# EAGLE design M510A (EAGLE 6.6.0)
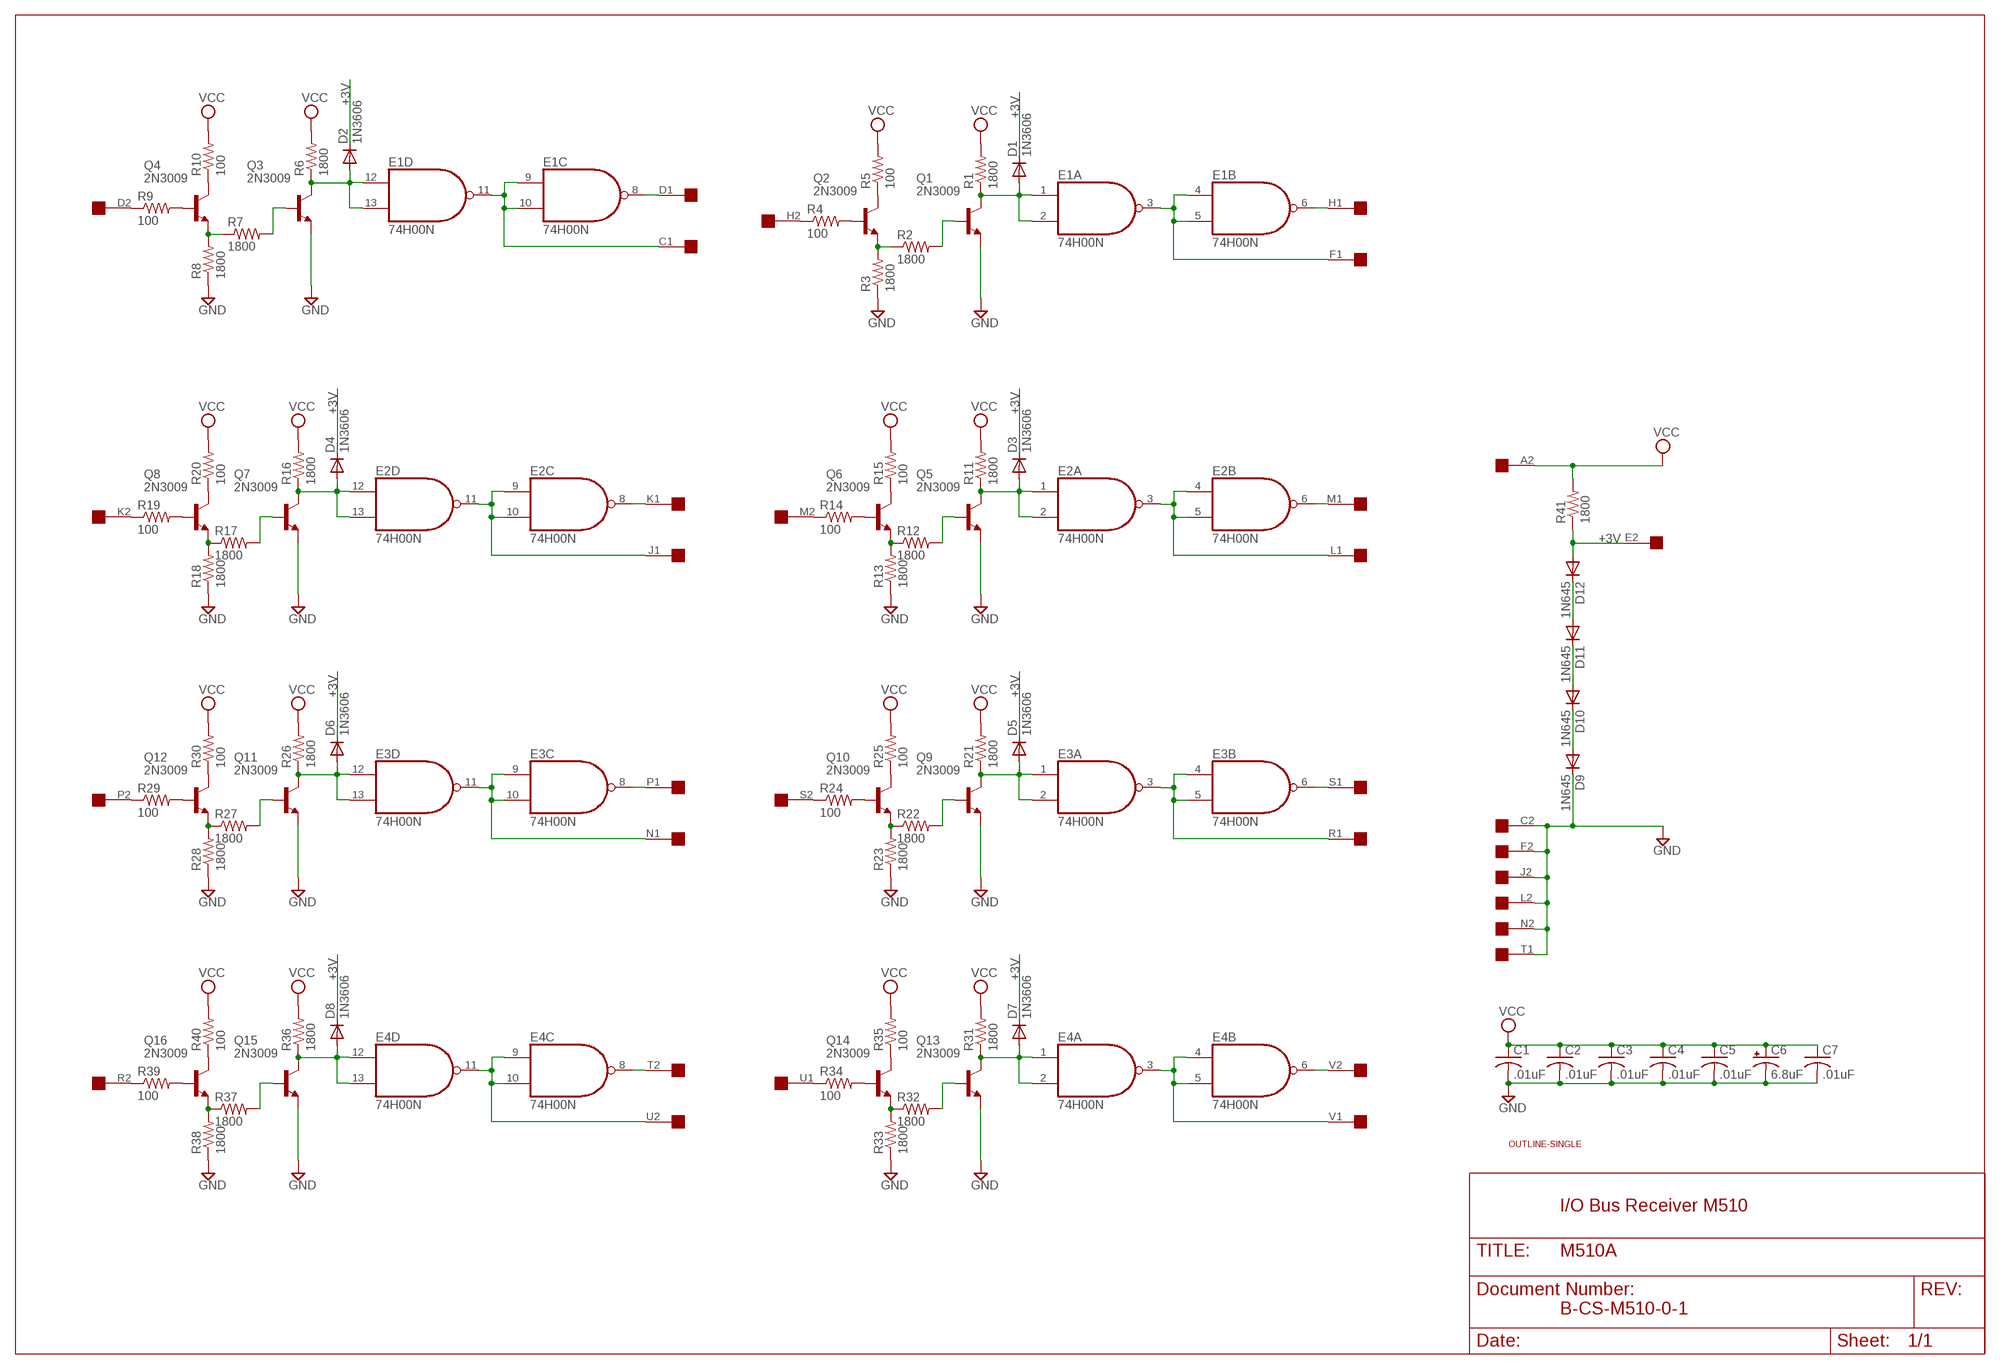
[diagram p0: schematic, sheet 1]

## Parts
C1  .01uF  C-US050-025X075  [C050-025X075]
C2  .01uF  C-US050-025X075  [C050-025X075]
C3  .01uF  C-US050-025X075  [C050-025X075]
C4  .01uF  C-US050-025X075  [C050-025X075]
C5  .01uF  C-US050-025X075  [C050-025X075]
C6  6.8uF  CPOL-USE20-8AXIAL  [E12-8]
C7  .01uF  C-US050-025X075  [C050-025X075]
D1  1N3606  1N4148DO35-10  [DO35-10]
D2  1N3606  1N4148DO35-10  [DO35-10]
D3  1N3606  1N4148DO35-10  [DO35-10]
D4  1N3606  1N4148DO35-10  [DO35-10]
D5  1N3606  1N4148DO35-10  [DO35-10]
D6  1N3606  1N4148DO35-10  [DO35-10]
D7  1N3606  1N4148DO35-10  [DO35-10]
D8  1N3606  1N4148DO35-10  [DO35-10]
D9  1N645  1N4148DO35-10  [DO35-10]
D10  1N645  1N4148DO35-10  [DO35-10]
D11  1N645  1N4148DO35-10  [DO35-10]
D12  1N645  1N4148DO35-10  [DO35-10]
E1  74H00N  7400N  [DIL14]
E2  74H00N  7400N  [DIL14]
E3  74H00N  7400N  [DIL14]
E4  74H00N  7400N  [DIL14]
EDGE1  EDGE-2CONNECTOR  [EDGE-CON2]
Q1  2N3009  2N3019  [TO39]
Q2  2N3009  2N3019  [TO39]
Q3  2N3009  2N3019  [TO39]
Q4  2N3009  2N3019  [TO39]
Q5  2N3009  2N3019  [TO39]
Q6  2N3009  2N3019  [TO39]
Q7  2N3009  2N3019  [TO39]
Q8  2N3009  2N3019  [TO39]
Q9  2N3009  2N3019  [TO39]
Q10  2N3009  2N3019  [TO39]
Q11  2N3009  2N3019  [TO39]
Q12  2N3009  2N3019  [TO39]
Q13  2N3009  2N3019  [TO39]
Q14  2N3009  2N3019  [TO39]
Q15  2N3009  2N3019  [TO39]
Q16  2N3009  2N3019  [TO39]
R1  1800  R-US_0207/10  [0207/10]
R2  1800  R-US_0207/10  [0207/10]
R3  1800  R-US_0207/10  [0207/10]
R4  100  R-US_0207/10  [0207/10]
R5  100  R-US_0207/10  [0207/10]
R6  1800  R-US_0207/10  [0207/10]
R7  1800  R-US_0207/10  [0207/10]
R8  1800  R-US_0207/10  [0207/10]
R9  100  R-US_0207/10  [0207/10]
R10  100  R-US_0207/10  [0207/10]
R11  1800  R-US_0207/10  [0207/10]
R12  1800  R-US_0207/10  [0207/10]
R13  1800  R-US_0207/10  [0207/10]
R14  100  R-US_0207/10  [0207/10]
R15  100  R-US_0207/10  [0207/10]
R16  1800  R-US_0207/10  [0207/10]
R17  1800  R-US_0207/10  [0207/10]
R18  1800  R-US_0207/10  [0207/10]
R19  100  R-US_0207/10  [0207/10]
R20  100  R-US_0207/10  [0207/10]
R21  1800  R-US_0207/10  [0207/10]
R22  1800  R-US_0207/10  [0207/10]
R23  1800  R-US_0207/10  [0207/10]
R24  100  R-US_0207/10  [0207/10]
R25  100  R-US_0207/10  [0207/10]
R26  1800  R-US_0207/10  [0207/10]
R27  1800  R-US_0207/10  [0207/10]
R28  1800  R-US_0207/10  [0207/10]
R29  100  R-US_0207/10  [0207/10]
R30  100  R-US_0207/10  [0207/10]
R31  1800  R-US_0207/10  [0207/10]
R32  1800  R-US_0207/10  [0207/10]
R33  1800  R-US_0207/10  [0207/10]
R34  100  R-US_0207/10  [0207/10]
R35  100  R-US_0207/10  [0207/10]
R36  1800  R-US_0207/10  [0207/10]
R37  1800  R-US_0207/10  [0207/10]
R38  1800  R-US_0207/10  [0207/10]
R39  100  R-US_0207/10  [0207/10]
R40  100  R-US_0207/10  [0207/10]
R41  1800  R-US_0207/10  [0207/10]
U$4  OUTLINE-SINGLE  [SINGLE]

## Nets
+3V [Supply]: D1.C D2.C D3.C D4.C D5.C D6.C D7.C D8.C D12.A EDGE1.E2 R41.1
GND [Supply]: C1.2 C2.2 C3.2 C4.2 C5.2 C6.- C7.2 D9.C EDGE1.C2 EDGE1.F2 EDGE1.J2 EDGE1.L2 EDGE1.N2 EDGE1.T1 Q1.1(E) Q3.1(E) Q5.1(E) Q7.1(E) Q9.1(E) Q11.1(E) Q13.1(E) Q15.1(E) R3.1 R8.1 R13.1 R18.1 R23.1 R28.1 R33.1 R38.1
N$1: EDGE1.D2 R9.1
N$2: Q4.2(B) R9.2
N$3: Q3.2(B) R7.2
N$4: E1.9(C:I0) E1.10(C:I1) E1.11(D:O) EDGE1.C1
N$5: Q4.3(C) R10.1
N$6: D2.A E1.12(D:I0) E1.13(D:I1) Q3.3(C) R6.1
N$7: EDGE1.H2 R4.1
N$8: Q4.1(E) R7.1 R8.2
N$9: E1.8(C:O) EDGE1.D1
N$10 [Supply]: D11.A D12.C
N$11 [Supply]: D10.A D11.C
N$12: D3.A E2.1(A:I0) E2.2(A:I1) Q5.3(C) R11.1
N$14: Q2.2(B) R4.2
N$15: D1.A E1.1(A:I0) E1.2(A:I1) Q1.3(C) R1.1
N$16: E1.3(A:O) E1.4(B:I0) E1.5(B:I1) EDGE1.F1
N$17: Q1.2(B) R2.2
N$18: Q2.3(C) R5.1
N$19: Q2.1(E) R2.1 R3.2
N$20: E1.6(B:O) EDGE1.H1
N$21: E2.3(A:O) E2.4(B:I0) E2.5(B:I1) EDGE1.L1
N$22: Q5.2(B) R12.2
N$23: E2.6(B:O) EDGE1.M1
N$24: Q6.1(E) R12.1 R13.2
N$25: Q6.2(B) R14.2
N$26: Q6.3(C) R15.1
N$27: D4.A E2.12(D:I0) E2.13(D:I1) Q7.3(C) R16.1
N$28: E2.9(C:I0) E2.10(C:I1) E2.11(D:O) EDGE1.J1
N$29: Q7.2(B) R17.2
N$30: E2.8(C:O) EDGE1.K1
N$31: Q8.1(E) R17.1 R18.2
N$32: Q8.2(B) R19.2
N$33: Q8.3(C) R20.1
N$34: D5.A E3.1(A:I0) E3.2(A:I1) Q9.3(C) R21.1
N$35: E3.3(A:O) E3.4(B:I0) E3.5(B:I1) EDGE1.R1
N$36: Q9.2(B) R22.2
N$37: E3.6(B:O) EDGE1.S1
N$38: Q10.1(E) R22.1 R23.2
N$39: Q10.2(B) R24.2
N$40: Q10.3(C) R25.1
N$41: D6.A E3.12(D:I0) E3.13(D:I1) Q11.3(C) R26.1
N$42: E3.9(C:I0) E3.10(C:I1) E3.11(D:O) EDGE1.N1
N$43: Q11.2(B) R27.2
N$44: E3.8(C:O) EDGE1.P1
N$45: Q12.1(E) R27.1 R28.2
N$46: Q12.2(B) R29.2
N$47: Q12.3(C) R30.1
N$48: EDGE1.K2 R19.1
N$49: EDGE1.M2 R14.1
N$50: D7.A E4.1(A:I0) E4.2(A:I1) Q13.3(C) R31.1
N$51 [Supply]: D9.A D10.C
N$52: E4.3(A:O) E4.4(B:I0) E4.5(B:I1) EDGE1.V1
N$53: Q13.2(B) R32.2
N$54: E4.6(B:O) EDGE1.V2
N$55: Q14.1(E) R32.1 R33.2
N$56: Q14.2(B) R34.2
N$57: Q14.3(C) R35.1
N$58: D8.A E4.12(D:I0) E4.13(D:I1) Q15.3(C) R36.1
N$59: E4.9(C:I0) E4.10(C:I1) E4.11(D:O) EDGE1.U2
N$60: Q15.2(B) R37.2
N$61: E4.8(C:O) EDGE1.T2
N$62: Q16.1(E) R37.1 R38.2
N$63: Q16.2(B) R39.2
N$64: Q16.3(C) R40.1
N$65: EDGE1.P2 R29.1
N$66: EDGE1.S2 R24.1
N$67: EDGE1.R2 R39.1
N$68: EDGE1.U1 R34.1
VCC [Supply]: C1.1 C2.1 C3.1 C4.1 C5.1 C6.+ C7.1 EDGE1.A2 R1.2 R5.2 R6.2 R10.2 R11.2 R15.2 R16.2 R20.2 R21.2 R25.2 R26.2 R30.2 R31.2 R35.2 R36.2 R40.2 R41.2
Unconnected: EDGE1.A1 EDGE1.B1 EDGE1.B2 EDGE1.E1

## Notes on the sheet
- I/O Bus Receiver M510
- B-CS-M510-0-1

## Power pins joined to a net without a drawn wire
GND: E1.7(P:GND) E2.7(P:GND) E3.7(P:GND) E4.7(P:GND)
VCC: E1.14(P:VCC) E2.14(P:VCC) E3.14(P:VCC) E4.14(P:VCC)

## Library data of the parts
C1-C5 C7 = rcl:C-US: CAPACITOR, American symbol
C6 = dec-con:CPOL-USE20-8AXIAL: A 0.8 inch electrolytic.
D1-D12 = diode:1N4148: DIODE high speed (Philips)
E1-E4 = 74xx-us:74*00: Quad 2-input NAND gate
EDGE1 = dec-con:EDGE-2: Double-Sided DEC edge connector.
Q1-Q16 = transistor-npn:2N3019: NPN Transistor
R1-R41 = rcl:R-US_: RESISTOR, American symbol
U$4 = dec-con:OUTLINE-*: Board outlines for DEC boards.

## Net classes
1 Supply: width 0.813 mm

## Board
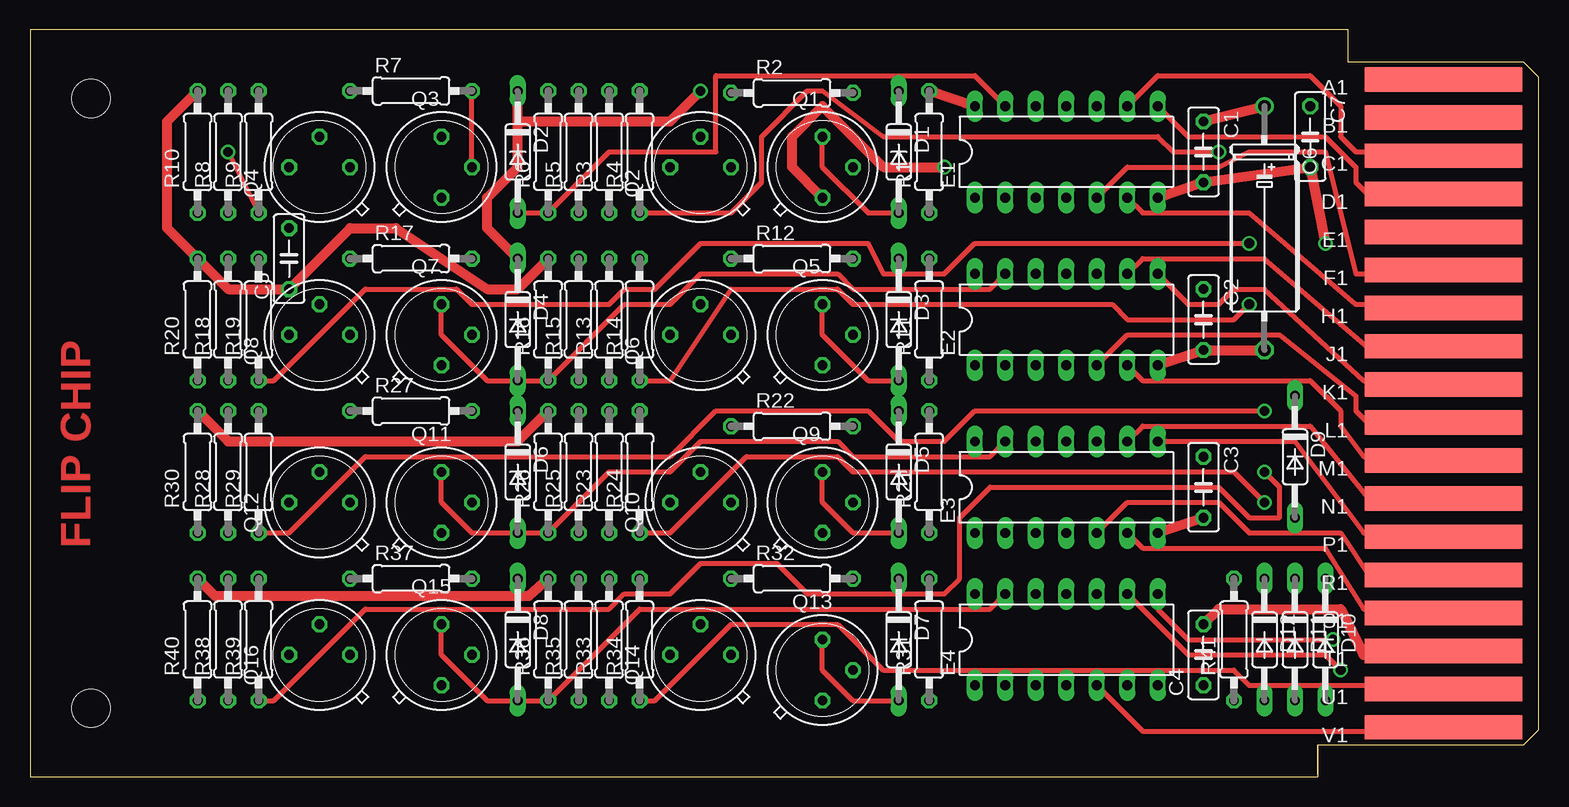
[diagram p1: board, top side]
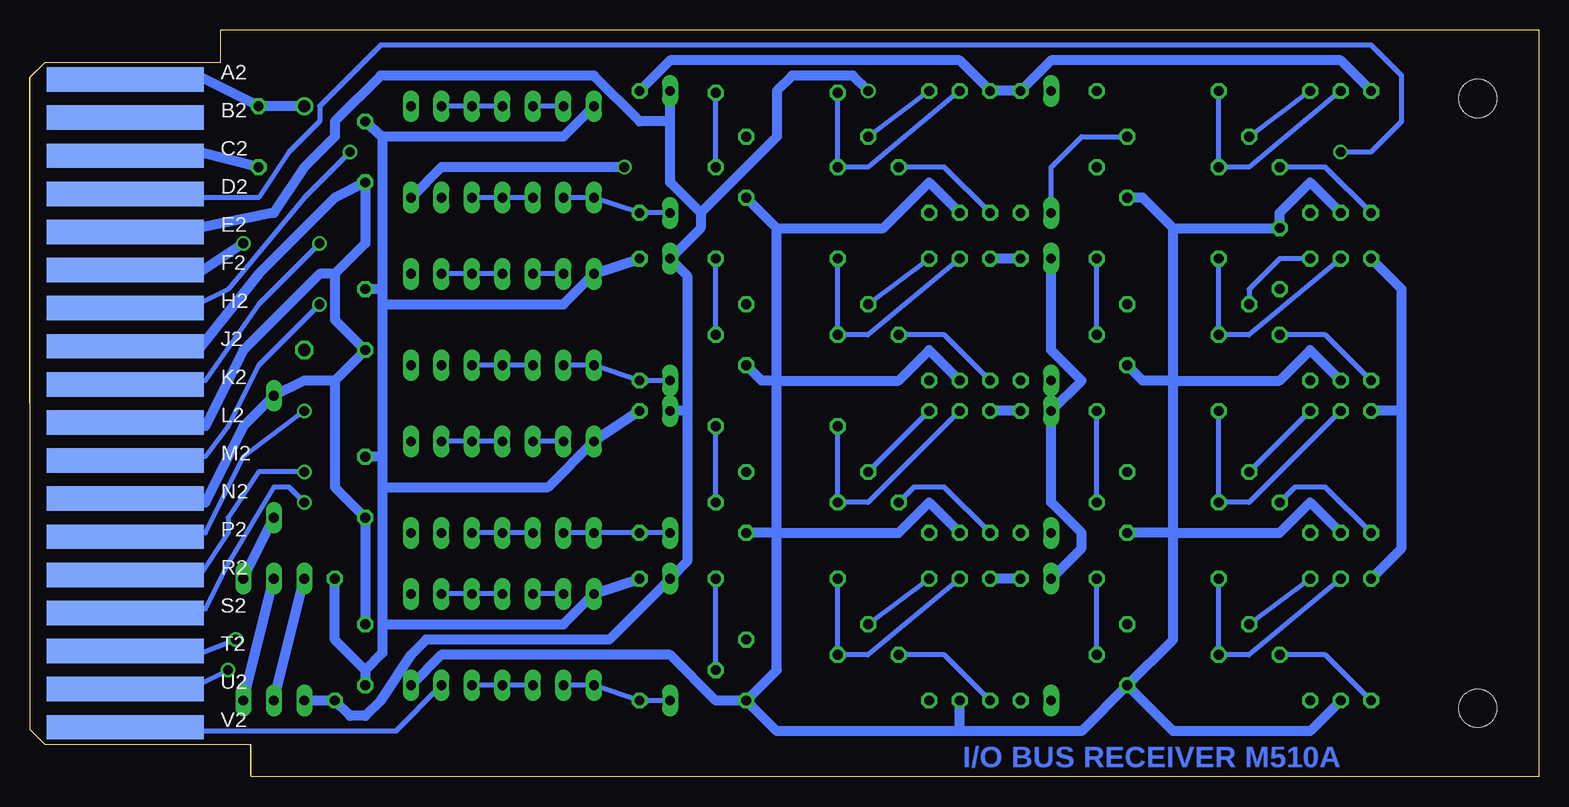
[diagram p2: board, bottom side, seen from below]

Size 125.73 x 62.23 mm. Coordinates in mm from the lower left corner, seen from the top.
Copper layers (1+16): Top 0.035mm / dielectric 1.5mm / Bottom 0.035mm
Design rules "16mils": minimum track width 16mil, minimum drill 32mil, track to track 15mil, track to pad 10mil, pad to pad 10mil, via to via 10mil, smd to smd 10mil, copper to edge 13mil, drill to drill 10mil, minimum pad ring 10mil, minimum via ring 8mil, stop-mask expansion 0mil, vias tented up to drill 0mil, thermal gap 10mil

### Footprints (pad centres in the part's own frame; a part is rotated, then mirrored left to right if it is on the bottom)
C050-025X075 = drill 0.813 octagon: 1 -2.54,0; 2 2.54,0
E12-8 = drill 1.016: + -10.16,0 | drill 1.016 octagon: - 10.16,0
DO35-10 = drill 0.813 long: A 5.08,0; C -5.08,0
DIL14 = drill 0.813 long: 1 -7.62,-3.81; 2 -5.08,-3.81; 3 -2.54,-3.81; 4 0,-3.81; 5 2.54,-3.81; 6 5.08,-3.81; 7 7.62,-3.81; 8 7.62,3.81; 9 5.08,3.81; 10 2.54,3.81; 11 0,3.81; 12 -2.54,3.81; 13 -5.08,3.81; 14 -7.62,3.81
EDGE-CON2 = smd 13.106 x 2.032: A1 7.938,4.128; B1 7.938,7.303; C1 7.938,10.477; D1 7.938,13.652; E1 7.938,16.828; F1 7.938,20.003; H1 7.938,23.177; J1 7.938,26.352; K1 7.938,29.527; L1 7.938,32.703; M1 7.938,35.877; N1 7.938,39.053; P1 7.938,42.227; R1 7.938,45.403; S1 7.938,48.578; T1 7.938,51.752; U1 7.938,54.928; V1 7.938,58.102 | smd 13.106 x 2.032 bottom: A2 7.938,4.128; B2 7.938,7.303; C2 7.938,10.477; D2 7.938,13.652; E2 7.938,16.828; F2 7.938,20.003; H2 7.938,23.177; J2 7.938,26.352; K2 7.938,29.527; L2 7.938,32.703; M2 7.938,35.877; N2 7.938,39.053; P2 7.938,42.227; R2 7.938,45.403; S2 7.938,48.578; T2 7.938,51.752; U2 7.938,54.928; V2 7.938,58.102
TO39 = drill 0.813 octagon: 1 0,-2.54; 2 2.54,0; 3 0,2.54
0207/10 = drill 0.813 octagon: 1 -5.08,0; 2 5.08,0
SINGLE = hole 3.175: 120.65,56.515; 120.65,5.715

### Placement (x,y rotation side)
C1  97.79,52.07 270 top
C2  97.79,38.1 270 top
C3  97.79,24.13 270 top
C4  97.79,10.16 90 top
C5  21.59,43.18 90 top
C6  102.87,45.72 270 top
C7  106.68,53.34 270 top
D1  72.39,52.07 270 top
D2  40.64,52.07 270 top
D3  72.39,38.1 270 top
D4  40.64,38.1 270 top
D5  72.39,25.4 270 top
D6  40.64,25.4 270 top
D7  72.39,11.43 270 top
D8  40.64,11.43 270 top
D9  105.41,26.67 270 top
D10  107.95,11.43 270 top
D11  105.41,11.43 270 top
D12  102.87,11.43 270 top
E1  86.36,52.07 0 top
E2  86.36,38.1 0 top
E3  86.36,24.13 0 top
E4  86.36,11.43 0 top
EDGE1  125.73,62.23 180 top
Q1  66.04,50.8 0 top
Q2  55.88,50.8 90 top
Q3  34.29,50.8 0 top
Q4  24.13,50.8 90 top
Q5  66.04,36.83 0 top
Q6  55.88,36.83 90 top
Q7  34.29,36.83 0 top
Q8  24.13,36.83 90 top
Q9  66.04,22.86 0 top
Q10  55.88,22.86 90 top
Q11  34.29,22.86 0 top
Q12  24.13,22.86 90 top
Q13  66.04,8.89 0 top
Q14  55.88,10.16 90 top
Q15  34.29,10.16 0 top
Q16  24.13,10.16 90 top
R1  74.93,52.07 90 top
R2  63.5,56.99 0 top
R3  48.26,52.07 90 top
R4  50.8,52.07 90 top
R5  45.72,52.07 90 top
R6  43.18,52.07 90 top
R7  31.75,57.15 0 top
R8  16.51,52.07 90 top
R9  19.05,52.07 90 top
R10  13.97,52.07 90 top
R11  74.93,38.1 90 top
R12  63.5,43.18 0 top
R13  48.26,38.1 90 top
R14  50.8,38.1 90 top
R15  45.72,38.1 90 top
R16  43.18,38.1 90 top
R17  31.75,43.18 0 top
R18  16.51,38.1 90 top
R19  19.05,38.1 90 top
R20  13.97,38.1 90 top
R21  74.93,25.4 90 top
R22  63.5,29.21 0 top
R23  48.26,25.4 90 top
R24  50.8,25.4 90 top
R25  45.72,25.4 90 top
R26  43.18,25.4 90 top
R27  31.75,30.48 0 top
R28  16.51,25.4 90 top
R29  19.05,25.4 90 top
R30  13.97,25.4 90 top
R31  74.93,11.43 90 top
R32  63.5,16.51 0 top
R33  48.26,11.43 90 top
R34  50.8,11.43 90 top
R35  45.72,11.43 90 top
R36  43.18,11.43 90 top
R37  31.75,16.51 0 top
R38  16.51,11.43 90 top
R39  19.05,11.43 90 top
R40  13.97,11.43 90 top
R41  100.33,11.43 90 top
U$1  [FLIPCHIP]  0,0 0 top
U$4  125.73,62.23 180 top

### Tracks (layer width: path | path; a pad name or v marks a point on that pad's centre or on a via)
+3V  (via drill 0.81)
  Top 0.813: v55.88,57.15 53.34,54.61 40.64,54.61 | 40.64,54.61 D2.C | D4.C 38.1,45.72 38.1,48.26 40.64,50.8 40.64,54.61
  Bottom 0.813: D12.A R41.1 99.06,5.08 97.79,5.08 96.52,6.35 93.98,10.16 92.71,11.43 77.47,11.43 D7.C 70.96,17.94 70.96,30.48 | 70.96,30.48 D5.C | 70.96,30.48 70.96,41.75 D3.C 69.85,45.72 69.85,46.99 | 69.85,46.99 72.39,49.53 72.39,54.61 | 72.39,54.61 D1.C | 69.85,46.99 63.5,53.34 63.5,57.15 62.23,58.42 57.15,58.42 v55.88,57.15 | D4.C 40.64,35.56 38.1,33.02 D6.C 40.64,22.86 38.1,20.32 38.1,19.05 D8.C | EDGE1.E2 116.84,45.72 111.76,45.72 105.41,46.99 102.87,50.8 100.33,53.34 100.33,54.61 96.52,58.42 78.74,58.42 74.93,54.61 72.39,54.61
GND  (via drill 0.81)
  Top 0.813: C6.- C2.2 E2.7 | C4.2 99.06,13.97 109.22,13.97 111.12,10.16 116.84,10.16 EDGE1.T1 | v107.95,44.45 C7.2 C1.2 E1.7 | Q1.1 63.5,50.8 63.5,53.34 66.04,55.88 71.12,50.8 v76.2,50.8 | C3.2 E3.7
  Bottom 0.813: R8.1 19.05,49.53 21.59,46.99 C5.2 30.48,45.72 | R18.1 19.05,35.56 21.59,33.02 30.48,33.02 | 30.48,33.02 33.02,33.02 Q7.1 | 30.48,33.02 30.48,45.72 | 30.48,45.72 33.02,48.26 Q3.1 | Q15.1 30.48,11.43 30.48,20.32 | 30.48,20.32 Q11.1 | 30.48,20.32 30.48,33.02 | R38.1 19.05,3.81 30.48,3.81 Q15.1 | Q13.1 63.5,3.81 48.26,3.81 | 48.26,3.81 38.1,3.81 Q15.1 | Q13.1 63.5,8.89 63.5,20.32 | 63.5,20.32 63.5,33.02 | 63.5,33.02 64.77,33.02 Q5.1 | 63.5,20.32 Q9.1 | 63.5,45.72 Q1.1 | 63.5,33.02 63.5,45.72 | C4.2 C3.2 100.33,24.13 100.33,33.02 | 100.33,33.02 C2.2 100.33,38.1 100.33,41.91 | 100.33,41.91 97.79,44.45 C1.2 100.33,48.26 106.68,41.91 111.76,35.56 116.84,35.56 EDGE1.J2 | R28.1 19.05,22.86 21.59,20.32 30.48,20.32 | R3.1 50.8,49.53 54.61,45.72 63.5,45.72 | R13.1 50.8,35.56 53.34,33.02 63.5,33.02 | R23.1 50.8,22.86 53.34,20.32 63.5,20.32 | 48.26,3.81 R33.1 | 100.33,33.02 102.87,33.02 D9.C 107.95,29.21 111.12,22.86 116.84,22.86 EDGE1.N2 | EDGE1.L2 116.84,29.21 111.12,29.21 107.95,35.56 101.6,41.91 100.33,41.91 | EDGE1.F2 116.84,41.91 111.76,41.91 v107.95,44.45 | EDGE1.C2 115.57,52.07 111.76,52.07 C7.2 | Q13.1 68.58,6.35 72.39,10.16 91.44,10.16 E4.7 | v76.2,50.8 91.44,50.8 E1.7
N$1  (via drill 0.81)
  Top 0.406: R9.1 v16.51,52.07
  Bottom 0.406: v16.51,52.07 13.97,52.07 11.43,54.61 11.43,58.42 13.97,60.96 96.52,60.96 101.6,55.88 101.6,54.61 104.14,52.07 106.68,48.26 116.84,48.26 EDGE1.D2
N$2
  Bottom 0.406: R9.2 Q4.2
N$3
  Top 0.406: Q3.2 R7.2
N$4
  Top 0.406: E1.9 93.98,58.42 106.68,58.42 109.22,55.88 109.22,53.34 110.49,52.07 116.84,52.07 EDGE1.C1
  Bottom 0.406: E1.11 E1.10 E1.9
N$5
  Bottom 0.406: Q4.3 17.78,50.8 R10.1
N$6
  Top 0.406: D2.A R6.1 48.26,52.07 57.15,52.07 57.15,58.42 78.74,58.42 E1.13
  Bottom 0.406: E1.13 E1.12 | Q3.3 38.1,53.34 40.64,50.8 D2.A
N$7  (via drill 0.81)
  Top 0.406: v99.06,52.07 95.25,52.07 93.98,53.34 71.12,53.34 66.04,57.15 64.77,57.15 60.96,53.34 60.96,49.53 58.42,46.99 R4.1
  Bottom 0.406: EDGE1.H2 116.84,39.37 111.76,39.37 109.22,40.64 102.87,48.26 v99.06,52.07
N$8
  Bottom 0.406: R8.2 24.13,50.8 Q4.1 R7.1
N$9
  Top 0.406: EDGE1.D1 116.84,48.26 111.76,48.26 110.49,49.53 110.49,50.8 107.95,53.34 96.52,53.34 E1.8
N$10
  Bottom 0.813: D11.A D12.C
N$11
  Bottom 0.813: D10.A D11.C
N$12
  Top 0.406: Q5.3 66.04,36.83 69.85,33.02 D3.A
  Bottom 0.406: D3.A R11.1 E2.1 E2.2
N$14
  Bottom 0.406: R4.2 Q2.2
N$15
  Top 0.406: Q1.3 66.04,50.8 69.85,46.99 D1.A
  Bottom 0.406: D1.A R1.1 E1.1 E1.2
N$16
  Top 0.406: EDGE1.F1 116.84,41.91 110.49,41.91 107.95,52.07 101.6,52.07 99.06,50.8 91.44,50.8 E1.5
  Bottom 0.406: E1.3 E1.4 E1.5
N$17
  Bottom 0.406: Q1.2 R2.2
N$18
  Bottom 0.406: Q2.3 49.53,50.8 R5.1
N$19
  Bottom 0.406: R3.2 55.88,50.8 Q2.1 R2.1
N$20
  Top 0.406: EDGE1.H1 116.84,39.37 110.49,39.37 101.6,46.99 92.71,46.99 E1.6
N$21
  Top 0.406: EDGE1.L1 116.84,29.21 111.76,29.21 110.49,30.48 110.49,31.75 104.14,36.83 91.44,36.83 E2.5
  Bottom 0.406: E2.3 E2.4 E2.5
N$22
  Bottom 0.406: Q5.2 R12.2
N$23
  Top 0.406: EDGE1.M1 116.84,26.67 111.12,26.67 109.22,29.21 109.22,30.48 106.68,33.02 92.71,33.02 E2.6
N$24
  Bottom 0.406: R12.1 Q6.1 55.88,36.83 R13.2
N$25
  Bottom 0.406: R14.2 Q6.2
N$26
  Bottom 0.406: Q6.3 49.53,36.83 R15.1
N$27
  Top 0.406: Q7.3 34.29,36.83 38.1,33.02 D4.A R16.1 49.53,39.37 53.34,39.37 55.88,41.91 67.31,41.91 68.58,40.64 80.01,40.64 E2.13
  Bottom 0.406: E2.13 E2.12
N$28
  Top 0.406: EDGE1.J1 116.84,35.56 111.76,35.56 102.87,43.18 92.71,43.18 E2.9
  Bottom 0.406: E2.11 E2.10 E2.9
N$29
  Bottom 0.406: Q7.2 R17.2
N$30
  Top 0.406: EDGE1.K1 116.84,33.02 111.12,33.02 102.87,40.64 100.33,40.64 99.06,39.37 96.52,39.37 E2.8
N$31
  Bottom 0.406: R17.1 Q8.1 24.13,36.83 R18.2
N$32
  Bottom 0.406: R19.2 21.59,43.18 24.13,40.64 Q8.2
N$33
  Bottom 0.406: Q8.3 17.78,36.83 R20.1
N$34
  Top 0.406: Q9.3 66.04,22.86 68.58,20.32 D5.A
  Bottom 0.406: D5.A R21.1 E3.1 E3.2
N$35
  Top 0.406: EDGE1.R1 116.84,16.51 111.76,16.51 109.22,20.32 101.6,20.32 99.06,22.86 91.44,22.86 E3.5
  Bottom 0.406: E3.3 E3.4 E3.5
N$36
  Bottom 0.406: Q9.2 R22.2
N$37
  Top 0.406: EDGE1.S1 116.84,13.97 111.12,13.97 107.95,19.05 92.71,19.05 E3.6
N$38
  Bottom 0.406: R23.2 55.88,22.86 Q10.1 R22.1
N$39
  Bottom 0.406: R24.2 Q10.2
N$40
  Bottom 0.406: Q10.3 52.07,24.13 49.53,24.13 R25.1
N$41
  Top 0.406: Q11.3 34.29,22.86 36.83,20.32 D6.A R26.1 48.26,25.4 53.34,25.4 55.88,27.94 67.31,27.94 68.58,26.67 80.01,26.67 E3.13
  Bottom 0.406: E3.13 E3.12
N$42
  Top 0.406: EDGE1.N1 116.84,22.86 111.76,22.86 106.68,29.21 92.71,29.21 E3.9
  Bottom 0.406: E3.11 E3.10 E3.9
N$43
  Bottom 0.406: Q11.2 R27.2
N$44
  Top 0.406: EDGE1.P1 116.84,20.32 111.12,20.32 105.41,27.94 E3.8
N$45
  Bottom 0.406: R27.1 Q12.1 24.13,22.86 R28.2
N$46
  Bottom 0.406: R29.2 Q12.2
N$47
  Bottom 0.406: Q12.3 20.32,24.13 17.78,24.13 R30.1
N$48  (via drill 0.81)
  Top 0.406: v101.6,44.45 78.74,44.45 76.2,41.91 71.12,41.91 69.85,44.45 55.88,44.45 52.07,40.64 49.53,40.64 48.26,39.37 36.83,39.37 35.56,40.64 27.94,40.64 20.32,33.02 R19.1
  Bottom 0.406: EDGE1.K2 116.84,33.02 111.12,33.02 106.68,39.37 v101.6,44.45
N$49  (via drill 0.81)
  Top 0.406: v101.6,39.37 100.33,38.1 91.44,38.1 90.17,39.37 68.58,39.37 67.31,40.64 58.42,40.64 53.34,33.02 R14.1
  Bottom 0.406: EDGE1.M2 116.84,26.67 111.12,26.67 109.22,29.21 106.68,34.29 v101.6,39.37
N$50
  Top 0.406: Q13.3 66.04,8.89 68.58,6.35 D7.A
  Bottom 0.406: E4.2 E4.1 R31.1 D7.A
N$51
  Bottom 0.813: D10.C D9.A
N$52
  Top 0.406: EDGE1.V1 116.84,3.81 92.71,3.81 E4.5
  Bottom 0.406: E4.3 E4.4 E4.5
N$53
  Bottom 0.406: Q13.2 R32.2
N$54
  Bottom 0.406: EDGE1.V2 116.84,3.81 95.25,3.81 E4.6
N$55
  Bottom 0.406: R32.1 Q14.1 55.88,10.16 R33.2
N$56
  Bottom 0.406: R34.2 Q14.2
N$57
  Bottom 0.406: Q14.3 49.53,10.16 R35.1
N$58
  Top 0.406: Q15.3 34.29,10.16 38.1,6.35 D8.A R36.1 50.8,13.97 80.01,13.97 E4.13
  Bottom 0.406: E4.13 E4.12
N$59  (via drill 0.81)
  Top 0.406: v109.22,8.89 107.95,10.16 96.52,10.16 E4.9
  Bottom 0.406: E4.11 E4.10 E4.9 | EDGE1.U2 116.84,7.62 111.76,7.62 v109.22,8.89
N$60
  Bottom 0.406: Q15.2 R37.2
N$61  (via drill 0.81)
  Top 0.406: v108.58,11.43 96.52,11.43 93.98,13.97 E4.8
  Bottom 0.406: EDGE1.T2 116.84,10.16 111.76,10.16 v108.58,11.43
N$62
  Bottom 0.406: R37.1 Q16.1 24.13,10.16 R38.2
N$63
  Bottom 0.406: R39.2 Q16.2
N$64
  Bottom 0.406: Q16.3 17.78,10.16 R40.1
N$65  (via drill 0.81)
  Top 0.406: R29.1 21.59,20.32 27.94,26.67 53.34,26.67 57.15,30.48 69.85,30.48 72.39,27.94 76.2,27.94 78.74,30.48 v102.87,30.48
  Bottom 0.406: EDGE1.P2 116.84,20.32 111.12,20.32 107.95,26.67 v102.87,30.48
N$66  (via drill 0.81)
  Top 0.406: v102.87,22.86 100.33,25.4 68.58,25.4 67.31,26.67 59.69,26.67 53.34,20.32 R24.1
  Bottom 0.406: EDGE1.S2 116.84,13.97 111.12,13.97 109.22,17.78 105.41,24.13 104.14,24.13 v102.87,22.86
N$67  (via drill 0.81)
  Top 0.406: R39.1 20.32,6.35 27.94,13.97 48.26,13.97 49.53,15.24 53.34,15.24 55.88,17.78 62.23,17.78 64.77,15.24 76.2,15.24 77.47,16.51 77.47,21.59 80.01,24.13 99.06,24.13 101.6,21.59 104.14,21.59 104.14,24.13 v102.87,25.4
  Bottom 0.406: EDGE1.R2 116.84,16.51 111.76,16.51 109.22,20.32 109.22,21.59 106.68,25.4 v102.87,25.4
N$68
  Top 0.406: EDGE1.U1 116.84,7.62 101.6,7.62 100.33,8.89 71.12,8.89 67.31,12.7 58.42,12.7 52.07,6.35 R34.1
VCC
  Top 0.813: R1.2 E1.14 | R40.2 15.4,15.08 41.59,15.08 R36.2 | C1.1 C6.+ | R16.2 40.64,40.64 38.1,40.64 30.48,45.72 26.67,45.72 C5.1 16.51,40.64 R20.2 11.43,45.72 11.43,54.61 R10.2 | R30.2 16.51,27.94 40.64,27.94 R26.2
  Bottom 0.813: R11.2 E2.14 81.28,39.37 96.36,39.37 | R21.2 E3.14 82.55,24.13 96.36,24.13 | R31.2 E4.14 81.28,12.7 96.36,12.7 | E1.14 81.28,53.34 96.36,53.34 | 96.36,53.34 C1.1 | 96.36,40.64 96.36,39.37 | 96.36,53.34 96.36,40.64 | 96.36,24.13 96.36,12.7 | 96.36,26.67 96.36,24.13 | 96.36,39.37 96.36,26.67 | 96.36,26.67 C3.1 | 96.36,40.64 C2.1 | 97.79,8.89 C4.1 | 97.79,8.89 96.36,10.32 96.36,12.7 | EDGE1.A2 116.84,58.42 111.76,58.42 C7.1 C6.+ | R40.2 11.43,19.05 11.43,30.48 | 11.43,30.48 11.43,40.64 R20.2 | 11.43,30.48 R30.2 | R10.2 16.51,59.69 40.64,59.69 R6.2 R5.2 48.26,59.69 72.39,59.69 R1.2 | R36.2 R35.2 | R41.2 100.33,11.43 97.79,8.89 | R26.2 R25.2 | R16.2 R15.2

### Text on the board
Bottom: I/O BUS RECEIVER M510A